# EAGLE design boneX_led_strip (EAGLE 6.3)
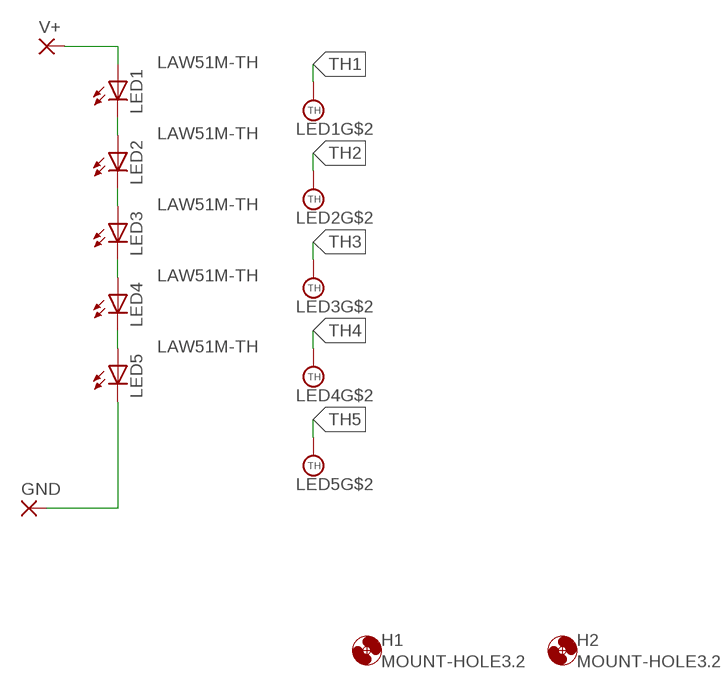
[diagram p0: schematic, sheet 1]

## Parts
GND  SMD5  [SMD2,54-5,08]
H1  MOUNT-HOLE3.2  [3,2]
H2  MOUNT-HOLE3.2  [3,2]
LED1  LAW51M-TH  [W51-COOL]
LED2  LAW51M-TH  [W51-COOL]
LED3  LAW51M-TH  [W51-COOL]
LED4  LAW51M-TH  [W51-COOL]
LED5  LAW51M-TH  [W51-COOL]
V+  SMD5  [SMD2,54-5,08]

## Nets
GND: GND.1(P) LED5.C
N$2: LED4.C LED5.A
N$3: LED3.C LED4.A
N$4: LED2.C LED3.A
N$5: LED1.C LED2.A
TH1: LED1.TH@1(TH) LED1.TH@2(TH) LED1.TH@3(TH) LED1.TH@4(TH) LED1.TH@5(TH) LED1.TH@6(TH) LED1.TH@7(TH) LED1.TH@8(TH) LED1.TH@9(TH) LED1.TH@10(TH) LED1.TH@11(TH) LED1.TH@12(TH)
TH2: LED2.TH@1(TH) LED2.TH@2(TH) LED2.TH@3(TH) LED2.TH@4(TH) LED2.TH@5(TH) LED2.TH@6(TH) LED2.TH@7(TH) LED2.TH@8(TH) LED2.TH@9(TH) LED2.TH@10(TH) LED2.TH@11(TH) LED2.TH@12(TH)
TH3: LED3.TH@1(TH) LED3.TH@2(TH) LED3.TH@3(TH) LED3.TH@4(TH) LED3.TH@5(TH) LED3.TH@6(TH) LED3.TH@7(TH) LED3.TH@8(TH) LED3.TH@9(TH) LED3.TH@10(TH) LED3.TH@11(TH) LED3.TH@12(TH)
TH4: LED4.TH@1(TH) LED4.TH@2(TH) LED4.TH@3(TH) LED4.TH@4(TH) LED4.TH@5(TH) LED4.TH@6(TH) LED4.TH@7(TH) LED4.TH@8(TH) LED4.TH@9(TH) LED4.TH@10(TH) LED4.TH@11(TH) LED4.TH@12(TH)
TH5: LED5.TH@1(TH) LED5.TH@2(TH) LED5.TH@3(TH) LED5.TH@4(TH) LED5.TH@5(TH) LED5.TH@6(TH) LED5.TH@7(TH) LED5.TH@8(TH) LED5.TH@9(TH) LED5.TH@10(TH) LED5.TH@11(TH) LED5.TH@12(TH)
V+: LED1.A V+.1(P)

## Library data of the parts
GND V+ = wirepad:SMD5: SMD PAD
H1 H2 = holes:MOUNT-HOLE: MOUNTING HOLE with drill center marker
LED1-LED5 = led:*W51M-TH: Golden DRAGON® with Lens Enhanced Thinfilm LED Source: LA_LR_LY_W51M_Pb_free[1].pdf

## Board
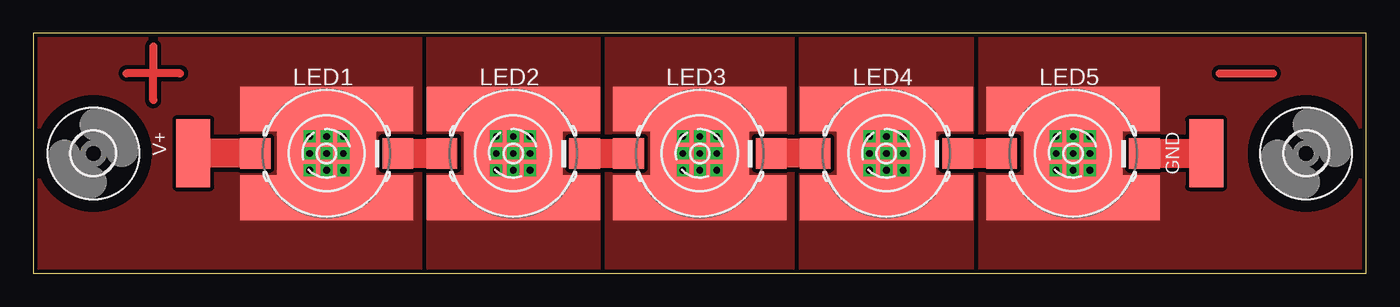
[diagram p1: board, top side]
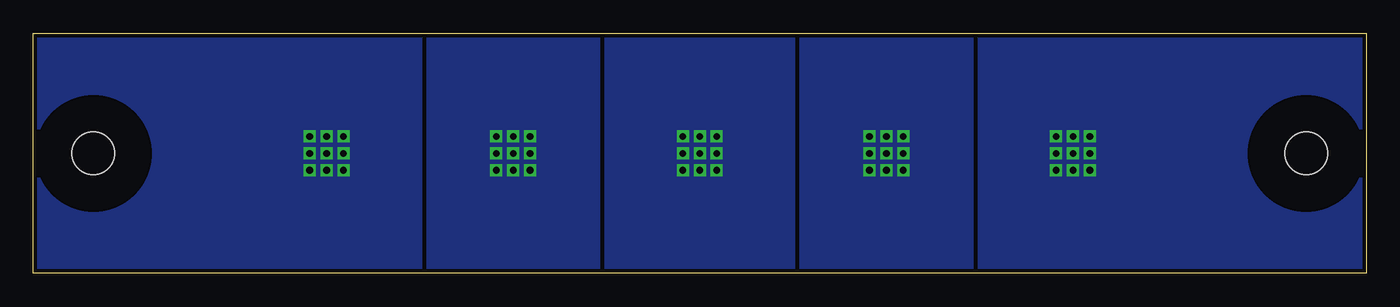
[diagram p2: board, bottom side, seen from below]

Size 100 x 18 mm. Coordinates in mm from the lower left corner, seen from the top.
Outline: 0,0 100,0 100,18 0,18 0,0
Copper layers (1*16): Top 0.035mm / dielectric 1.5mm / Bottom 0.035mm
Design rules "PCB-POOL Standard": minimum track width 0.15mm, minimum drill 0.3mm, track to track 0.15mm, track to pad 0.15mm, pad to pad 0.15mm, via to via 0.15mm, smd to smd 0.15mm, copper to edge 0.3mm, drill to drill 0.2mm, minimum pad ring 0.2mm, minimum via ring 0.15mm, stop-mask expansion 0.075mm, vias tented up to drill 0mil, thermal gap 0.2mm

### Footprints (pad centres in the part's own frame; a part is rotated, then mirrored left to right if it is on the bottom)
SMD2,54-5,08 = smd 2.54 x 5.08: 1 0,0
3,2 = hole 3.2: 0,0
W51-COOL = smd 2.3 x 2.3: A -5.35,0; C 5.35,0 | smd 7.4 x 3.4: TH@1 0,0 | smd 13 x 3.35: TH@2 0,3.325; TH@3 0,-3.325 | drill 0.5 pad 0.9 square: TH@4 -1.27,1.27; TH@5 0,1.27; TH@6 1.27,1.27; TH@7 -1.27,0; TH@8 0,0; TH@9 1.27,0; TH@10 -1.27,-1.27; TH@11 0,-1.27; TH@12 1.27,-1.27

### Placement (x,y rotation side)
GND  88,9 180 top
H1  4.5,9 0 top
H2  95.5,9 0 top
LED1  22,9 0 top
LED2  36,9 0 top
LED3  50,9 0 top
LED4  64,9 0 top
LED5  78,9 0 top
V+  12,9 180 top

### Tracks (layer width: path | path; a pad name or v marks a point on that pad's centre or on a via)
GND
  Top 2.184: LED5.C GND.1 88,10
N$2
  Top 2.184: LED4.C LED5.A
N$3
  Top 2.184: LED4.A LED3.C
N$4
  Top 2.184: LED2.C LED3.A
N$5
  Top 2.184: LED1.C LED2.A
N$7
  Top 0.61: 9,17 9,15 | 11,15 9,15 | 9,13 9,15 | 9,15 7,15
N$8
  Top 0.61: 89,15 93,15
TH1
  pour Top (isolate 0.305, no thermals): 0,18 29,18 29,0 0,0
  pour Bottom (isolate 0.305, no thermals): 0,0 29,0 29,18 0,18
TH2
  pour Top (isolate 0.305, rank 2, no thermals): 29,0 43,0 43,18 29,18
  pour Bottom (isolate 0.305, rank 2, no thermals): 29,0 43,0 43,18 29,18
TH3
  pour Top (isolate 0.305, no thermals): 43,0 57,0 57,18 43,18
  pour Bottom (isolate 0.305, no thermals): 43,0 57,0 57,18 43,18
TH4
  pour Top (isolate 0.305, rank 2, no thermals): 57,0 71,0 71,18 57,18
  pour Bottom (isolate 0.305, rank 2, no thermals): 57,0 71,0 71,18 57,18
TH5
  pour Top (isolate 0.305, no thermals): 71,0 100,0 100,18 71,18
  pour Bottom (isolate 0.305, no thermals): 71,0 100,0 100,18 71,18
V+
  Top 2.184: LED1.A V+.1